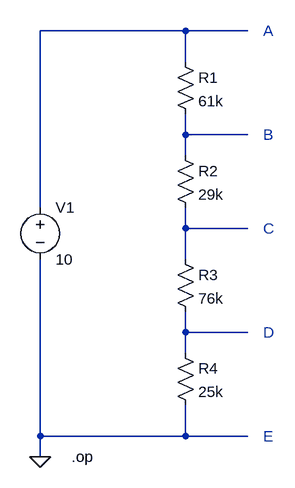
[diagram p0: schematic lab1_1.asc]
lab1_1.asc, the LTspice schematic file:
Version 4
SHEET 1 880 680
WIRE 128 -432 -96 -432
WIRE 224 -432 128 -432
WIRE 128 -384 128 -432
WIRE 128 -272 128 -304
WIRE 224 -272 128 -272
WIRE 128 -240 128 -272
WIRE -96 -160 -96 -432
WIRE 128 -128 128 -160
WIRE 224 -128 128 -128
WIRE 128 -80 128 -128
WIRE 128 32 128 0
WIRE 224 32 128 32
WIRE 128 64 128 32
WIRE -96 192 -96 -80
WIRE 128 192 128 144
WIRE 128 192 -96 192
WIRE 224 192 128 192
WIRE -96 224 -96 192
FLAG -96 224 0
SYMBOL res 112 -400 R0
SYMATTR InstName R1
SYMATTR Value 61k
SYMBOL res 112 -256 R0
SYMATTR InstName R2
SYMATTR Value 29k
SYMBOL res 112 -96 R0
SYMATTR InstName R3
SYMATTR Value 76k
SYMBOL res 112 48 R0
SYMATTR InstName R4
SYMATTR Value 25k
SYMBOL voltage -96 -176 R0
WINDOW 123 0 0 Left 0
WINDOW 39 0 0 Left 0
SYMATTR InstName V1
SYMATTR Value 10
TEXT -48 224 Left 2 !.op
TEXT 248 -432 Left 2 ;A
TEXT 248 -272 Left 2 ;B
TEXT 248 -128 Left 2 ;C
TEXT 248 32 Left 2 ;D
TEXT 248 192 Left 2 ;E

The netlist it stands for:
* lab1_1.asc
R1 N001 N002 61k
R2 N002 N003 29k
R3 N003 N004 76k
R4 N004 0 25k
V1 N001 0 10
.op
* A
* B
* C
* D
* E
.backanno
.end